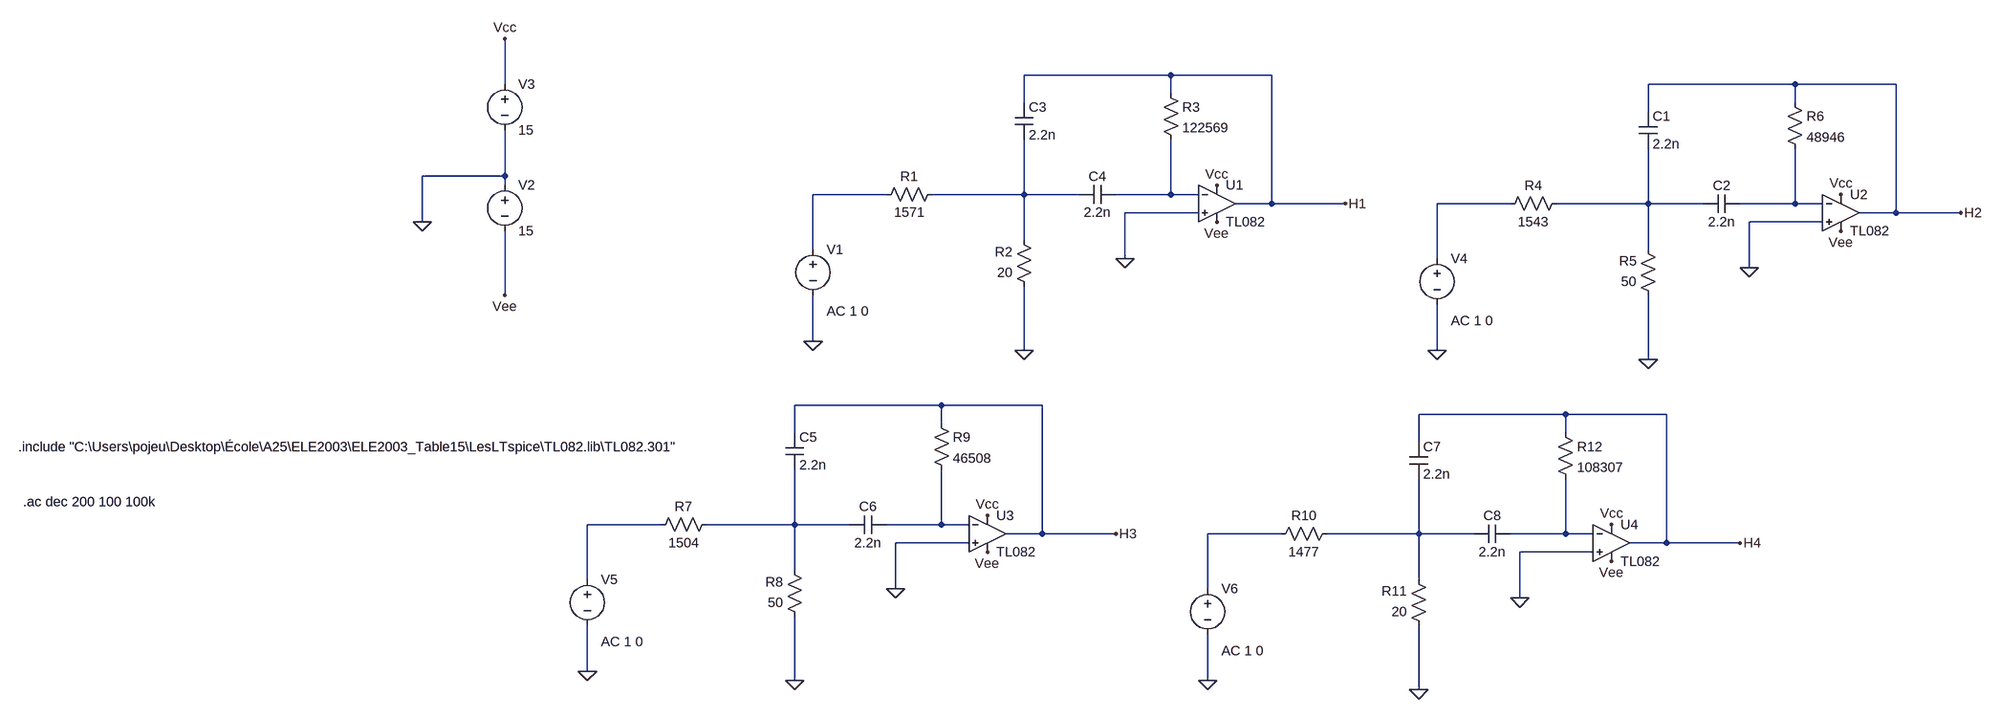
[diagram p0: schematic Filtres separes.asc]
Filtres separes.asc, the LTspice schematic file:
Version 4.1
SHEET 1 2032 1060
WIRE 592 -32 336 -32
WIRE 768 -32 592 -32
WIRE -576 -16 -576 -96
WIRE 1680 -16 1424 -16
WIRE 1856 -16 1680 -16
WIRE 592 0 592 -32
WIRE 336 16 336 -32
WIRE 1680 16 1680 -16
WIRE 1424 32 1424 -16
WIRE -576 144 -576 64
WIRE -576 144 -720 144
WIRE -576 160 -576 144
WIRE 96 176 -32 176
WIRE 336 176 336 80
WIRE 336 176 176 176
WIRE 432 176 336 176
WIRE 592 176 592 80
WIRE 592 176 496 176
WIRE 640 176 592 176
WIRE 768 192 768 -32
WIRE 768 192 704 192
WIRE 896 192 768 192
WIRE 1184 192 1056 192
WIRE 1424 192 1424 96
WIRE 1424 192 1264 192
WIRE 1520 192 1424 192
WIRE 1680 192 1680 96
WIRE 1680 192 1584 192
WIRE 1728 192 1680 192
WIRE 640 208 512 208
WIRE 1856 208 1856 -16
WIRE 1856 208 1792 208
WIRE 1984 208 1856 208
WIRE -720 224 -720 144
WIRE 1728 224 1600 224
WIRE 336 256 336 176
WIRE -32 272 -32 176
WIRE 1424 272 1424 192
WIRE 512 288 512 208
WIRE 1056 288 1056 192
WIRE 1600 304 1600 224
WIRE -576 352 -576 240
WIRE -32 432 -32 352
WIRE 336 448 336 336
WIRE 1056 448 1056 368
WIRE 1424 464 1424 352
WIRE 192 544 -64 544
WIRE 368 544 192 544
WIRE 1280 560 1024 560
WIRE 1456 560 1280 560
WIRE 192 576 192 544
WIRE -64 592 -64 544
WIRE 1280 592 1280 560
WIRE 1024 608 1024 560
WIRE -304 752 -432 752
WIRE -64 752 -64 656
WIRE -64 752 -224 752
WIRE 32 752 -64 752
WIRE 192 752 192 656
WIRE 192 752 96 752
WIRE 240 752 192 752
WIRE 368 768 368 544
WIRE 368 768 304 768
WIRE 496 768 368 768
WIRE 784 768 656 768
WIRE 1024 768 1024 672
WIRE 1024 768 864 768
WIRE 1120 768 1024 768
WIRE 1280 768 1280 672
WIRE 1280 768 1184 768
WIRE 1328 768 1280 768
WIRE 240 784 112 784
WIRE 1456 784 1456 560
WIRE 1456 784 1392 784
WIRE 1584 784 1456 784
WIRE 1328 800 1200 800
WIRE -64 832 -64 752
WIRE -432 848 -432 752
WIRE 1024 848 1024 768
WIRE 112 864 112 784
WIRE 656 864 656 768
WIRE 1200 880 1200 800
WIRE -432 1008 -432 928
WIRE -64 1024 -64 912
WIRE 656 1024 656 944
WIRE 1024 1040 1024 928
FLAG 336 448 0
FLAG -32 432 0
FLAG -720 224 0
FLAG -576 -96 Vcc
FLAG -576 352 Vee
FLAG 672 160 Vcc
FLAG 672 224 Vee
FLAG 512 288 0
FLAG 1424 464 0
FLAG 1056 448 0
FLAG 1760 176 Vcc
FLAG 1760 240 Vee
FLAG 1600 304 0
FLAG -64 1024 0
FLAG -432 1008 0
FLAG 272 736 Vcc
FLAG 272 800 Vee
FLAG 112 864 0
FLAG 1024 1040 0
FLAG 656 1024 0
FLAG 1360 752 Vcc
FLAG 1360 816 Vee
FLAG 1200 880 0
FLAG 896 192 H1
FLAG 1984 208 H2
FLAG 496 768 H3
FLAG 1584 784 H4
SYMBOL res 192 160 R90
WINDOW 0 0 56 VBottom 2
WINDOW 3 32 56 VTop 2
SYMATTR InstName R1
SYMATTR Value 1571
SYMBOL res 352 352 R180
WINDOW 0 36 76 Left 2
WINDOW 3 36 40 Left 2
SYMATTR InstName R2
SYMATTR Value 20
SYMBOL cap 320 16 R0
SYMATTR InstName C3
SYMATTR Value 2.2n
SYMBOL cap 496 160 R90
WINDOW 0 0 32 VBottom 2
WINDOW 3 32 32 VTop 2
SYMATTR InstName C4
SYMATTR Value 2.2n
SYMBOL res 576 -16 R0
SYMATTR InstName R3
SYMATTR Value 122569
SYMBOL voltage -32 256 R0
WINDOW 123 24 124 Left 2
WINDOW 39 0 0 Left 0
SYMATTR Value2 AC 1 0
SYMATTR InstName V1
SYMATTR Value ""
SYMBOL voltage -576 144 R0
SYMATTR InstName V2
SYMATTR Value 15
SYMBOL voltage -576 -32 R0
SYMATTR InstName V3
SYMATTR Value 15
SYMBOL OpAmps\\opamp2 672 128 R0
SYMATTR InstName U1
SYMATTR Value TL082
SYMBOL res 1280 176 R90
WINDOW 0 0 56 VBottom 2
WINDOW 3 32 56 VTop 2
SYMATTR InstName R4
SYMATTR Value 1543
SYMBOL res 1440 368 R180
WINDOW 0 36 76 Left 2
WINDOW 3 36 40 Left 2
SYMATTR InstName R5
SYMATTR Value 50
SYMBOL cap 1408 32 R0
SYMATTR InstName C1
SYMATTR Value 2.2n
SYMBOL cap 1584 176 R90
WINDOW 0 0 32 VBottom 2
WINDOW 3 32 32 VTop 2
SYMATTR InstName C2
SYMATTR Value 2.2n
SYMBOL res 1664 0 R0
SYMATTR InstName R6
SYMATTR Value 48946
SYMBOL voltage 1056 272 R0
WINDOW 123 24 124 Left 2
WINDOW 39 0 0 Left 0
SYMATTR Value2 AC 1 0
SYMATTR InstName V4
SYMATTR Value ""
SYMBOL OpAmps\\opamp2 1760 144 R0
SYMATTR InstName U2
SYMATTR Value TL082
SYMBOL res -208 736 R90
WINDOW 0 0 56 VBottom 2
WINDOW 3 32 56 VTop 2
SYMATTR InstName R7
SYMATTR Value 1504
SYMBOL res -48 928 R180
WINDOW 0 36 76 Left 2
WINDOW 3 36 40 Left 2
SYMATTR InstName R8
SYMATTR Value 50
SYMBOL cap -80 592 R0
SYMATTR InstName C5
SYMATTR Value 2.2n
SYMBOL cap 96 736 R90
WINDOW 0 0 32 VBottom 2
WINDOW 3 32 32 VTop 2
SYMATTR InstName C6
SYMATTR Value 2.2n
SYMBOL res 176 560 R0
SYMATTR InstName R9
SYMATTR Value 46508
SYMBOL voltage -432 832 R0
WINDOW 123 24 124 Left 2
WINDOW 39 0 0 Left 0
SYMATTR Value2 AC 1 0
SYMATTR InstName V5
SYMATTR Value ""
SYMBOL OpAmps\\opamp2 272 704 R0
SYMATTR InstName U3
SYMATTR Value TL082
SYMBOL res 880 752 R90
WINDOW 0 0 56 VBottom 2
WINDOW 3 32 56 VTop 2
SYMATTR InstName R10
SYMATTR Value 1477
SYMBOL res 1040 944 R180
WINDOW 0 36 76 Left 2
WINDOW 3 36 40 Left 2
SYMATTR InstName R11
SYMATTR Value 20
SYMBOL cap 1008 608 R0
SYMATTR InstName C7
SYMATTR Value 2.2n
SYMBOL cap 1184 752 R90
WINDOW 0 0 32 VBottom 2
WINDOW 3 32 32 VTop 2
SYMATTR InstName C8
SYMATTR Value 2.2n
SYMBOL res 1264 576 R0
SYMATTR InstName R12
SYMATTR Value 108307
SYMBOL voltage 656 848 R0
WINDOW 123 24 124 Left 2
WINDOW 39 0 0 Left 0
SYMATTR Value2 AC 1 0
SYMATTR InstName V6
SYMATTR Value ""
SYMBOL OpAmps\\opamp2 1360 720 R0
SYMATTR InstName U4
SYMATTR Value TL082
TEXT -1424 616 Left 2 !.include "C:\\Users\\pojeu\\Desktop\\École\\A25\\ELE2003\\ELE2003_Table15\\LesLTspice\\TL082.lib\\TL082.301"
TEXT -1416 712 Left 2 !.ac dec 200 100 100k

The netlist it stands for:
* Filtres separes.asc
R1 N002 N001 1571
R2 0 N002 20
C3 H1 N002 2.2n
C4 N003 N002 2.2n
R3 H1 N003 122569
V1 N001 0 AC 1 0
V2 0 Vee 15
V3 Vcc 0 15
X§U1 0 N003 Vcc Vee H1 TL082  ; pins In+ In- V+ V- OUT
R4 N005 N004 1543
R5 0 N005 50
C1 H2 N005 2.2n
C2 N006 N005 2.2n
R6 H2 N006 48946
V4 N004 0 AC 1 0
X§U2 0 N006 Vcc Vee H2 TL082  ; pins In+ In- V+ V- OUT
R7 N008 N007 1504
R8 0 N008 50
C5 H3 N008 2.2n
C6 N009 N008 2.2n
R9 H3 N009 46508
V5 N007 0 AC 1 0
X§U3 0 N009 Vcc Vee H3 TL082  ; pins In+ In- V+ V- OUT
R10 N011 N010 1477
R11 0 N011 20
C7 H4 N011 2.2n
C8 N012 N011 2.2n
R12 H4 N012 108307
V6 N010 0 AC 1 0
X§U4 0 N012 Vcc Vee H4 TL082  ; pins In+ In- V+ V- OUT
.include "C:\Users\pojeu\Desktop\École\A25\ELE2003\ELE2003_Table15\LesLTspice\TL082.lib\TL082.301"
.ac dec 200 100 100k
.backanno
.end